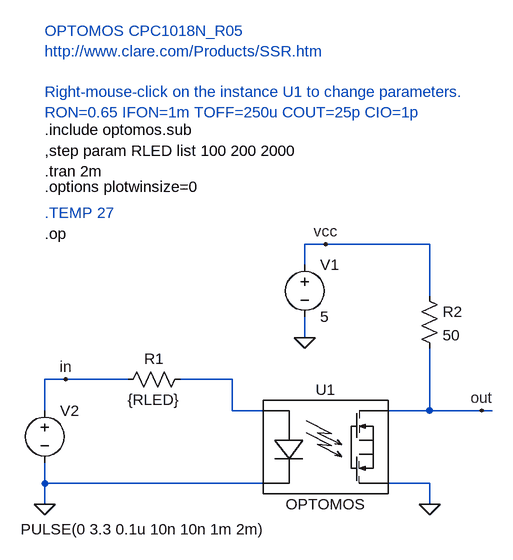
[diagram p0: schematic optomos_func_test1.asc]
optomos_func_test1.asc, the LTspice schematic file:
Version 4
SHEET 1 2328 1460
WIRE 432 528 400 528
WIRE 592 528 432 528
WIRE 400 560 400 528
WIRE 592 608 592 528
WIRE 400 672 400 640
WIRE 32 736 0 736
WIRE 128 736 32 736
WIRE 288 736 208 736
WIRE 0 784 0 736
WIRE 288 784 288 736
WIRE 336 784 288 784
WIRE 592 784 592 688
WIRE 592 784 528 784
WIRE 672 784 592 784
WIRE 688 784 672 784
WIRE 0 896 0 864
WIRE 336 896 0 896
WIRE 592 896 528 896
WIRE 0 928 0 896
WIRE 592 928 592 896
FLAG 400 672 0
FLAG 592 928 0
FLAG 432 528 vcc
FLAG 0 928 0
FLAG 32 736 in
FLAG 672 784 out
SYMBOL voltage 400 544 R0
SYMATTR InstName V1
SYMATTR Value 5
SYMBOL res 112 752 R270
WINDOW 0 32 56 VTop 0
WINDOW 3 0 56 VBottom 0
SYMATTR InstName R1
SYMATTR Value {RLED}
SYMBOL voltage 0 768 R0
WINDOW 3 -37 199 Left 0
WINDOW 123 0 0 Left 0
WINDOW 39 0 0 Left 0
SYMATTR Value PULSE(0 3.3 0.1u 10n 10n 1m 2m)
SYMATTR InstName V2
SYMBOL res 576 592 R0
SYMATTR InstName R2
SYMATTR Value 50
SYMBOL optomos 432 848 R0
SYMATTR InstName U1
TEXT 0 512 Left 0 !.op
TEXT 0 480 Left 0 ;.TEMP 27
TEXT 0 416 Left 0 !.tran 2m
TEXT 0 440 Left 0 !.options plotwinsize=0
TEXT 0 384 Left 0 !,step param RLED list 100 200 2000
TEXT 0 352 Left 0 !.include optomos.sub
TEXT 0 200 Left 0 ;OPTOMOS CPC1018N_R05\nhttp://www.clare.com/Products/SSR.htm\n \nRight-mouse-click on the instance U1 to change parameters.\nRON=0.65 IFON=1m TOFF=250u COUT=25p CIO=1p

The netlist it stands for:
* optomos_func_test1.asc
V1 vcc 0 5
R1 in N001 {RLED}
V2 in 0 PULSE(0 3.3 0.1u 10n 10n 1m 2m)
R2 vcc out 50
XU1 N001 0 0 out OPTOMOS RON=0.65 IFON=1m TOFF=250u COUT=25p CIO=1p  ; pins A K D1 D2
.op
* .TEMP 27
.tran 2m
.options plotwinsize=0
,step param RLED list 100 200 2000
.include optomos.sub
* OPTOMOS CPC1018N_R05
* http://www.clare.com/Products/SSR.htm
* Right-mouse-click on the instance U1 to change parameters.
* RON=0.65 IFON=1m TOFF=250u COUT=25p CIO=1p
.backanno
.end